# EasyEDA Pro project Sequencer.epro

# Schematic Schematic1
Board Name: Board1; Create Date: 2026-06-06; Page Name: P1; Project Name: Blinky; Schematic Name: Schematic1; Update Date: 2026-06-07; Company: EasyEDA.com; Page Size: A4; Version: V1.0
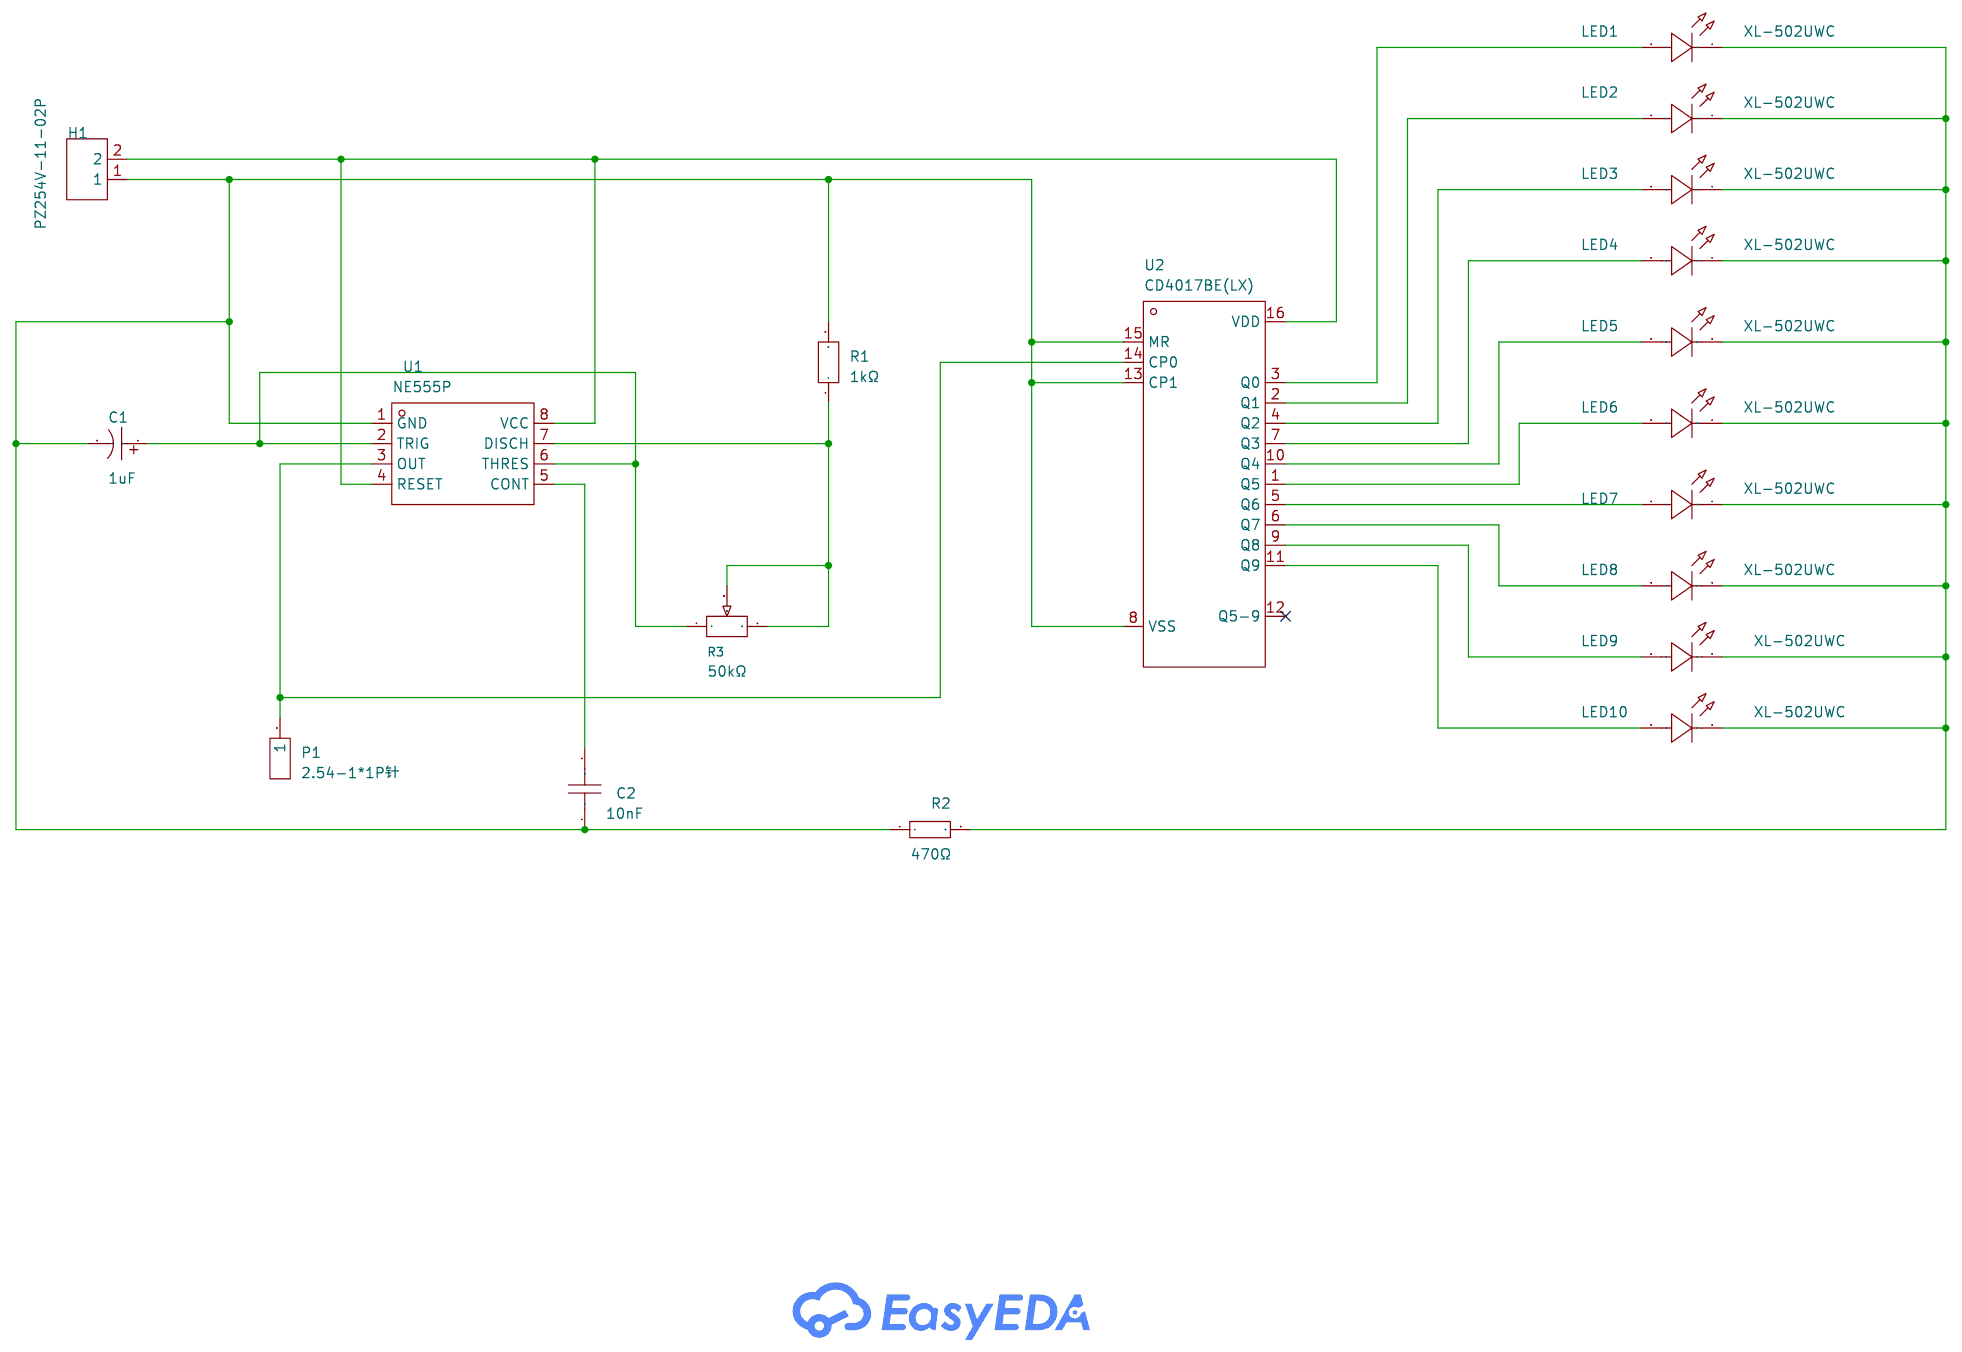
[diagram p0: schematic sheet]

## Parts
C1  1uF  [CAP-TH_BD5.0-P2.00-D0.8-FD]
C2  10nF  [CAP-TH_L8.0-W4.0-P5.00-D1.2]
H1  PZ254V-11-02P  [HDR-TH_2P-P2.54-V-M]
LED1  XL-502UWC  [LED-TH_BD5.9-P2.54-RD_WHITE]
LED2  XL-502UWC  [LED-TH_BD5.9-P2.54-RD_WHITE]
LED3  XL-502UWC  [LED-TH_BD5.9-P2.54-RD_WHITE]
LED4  XL-502UWC  [LED-TH_BD5.9-P2.54-RD_WHITE]
LED5  XL-502UWC  [LED-TH_BD5.9-P2.54-RD_WHITE]
LED6  XL-502UWC  [LED-TH_BD5.9-P2.54-RD_WHITE]
LED7  XL-502UWC  [LED-TH_BD5.9-P2.54-RD_WHITE]
LED8  XL-502UWC  [LED-TH_BD5.9-P2.54-RD_WHITE]
LED9  XL-502UWC  [LED-TH_BD5.9-P2.54-RD_WHITE]
LED10  XL-502UWC  [LED-TH_BD5.9-P2.54-RD_WHITE]
P1  2.54-1*1P针  [HDR-TH_1P-P2.54-V-M]
R1  1kΩ  [RES-TH_BD2.3-L6.5-P10.50-D0.5]
R2  470Ω  [RES-TH_BD2.2-L6.5-P10.50-D0.6]
R3  50kΩ  [RES-ADJ-TH_3P-L9.5-W4.85-P2.50-BL-L]
U1  NE555P  [DIP-8_L9.8-W6.6-P2.54-LS7.6-BL]
U2  CD4017BE(LX)  [PDIP-16_L19.3-W6.4-P2.54-LS7.94-BL]

## Library data of the parts
C1 = KF010M050C110A: Capacitance:1uF Tolerance:±20% Tolerance:±20% Voltage Rating:50V Pin Spacing:2mm Diameter:5mm Height - Seated (Max):11mm Lifetime:2000hrs@105℃; LCSC Part Name: 1uF ±20% 50V; Supplier Part: C62934; Manufacturer: CapXon(丰宾); Supplier Footprint: 插件,D5xL11mm; JLCPCB Part Class: Extended Part; Datasheet: https://item.szlcsc.com/datasheet/KF010M050C110A/63997.html; Supplier: LCSC; Tolerance: ±20%; Voltage Rating: 50V; Pin Spacing: 2mm; Diameter: 5mm; Height - Seated (Max): 11mm; Lifetime: 2000hrs@105℃; Check: true
C2 = N09F1B103MN0B0S0N0: Capacitance:10nF Tolerance:±20% Tolerance:±20% Voltage Rating:1kV Pin Spacing:5mm Temperature Coefficient:Y5V Diameter:8.5mm Body Thickness:2.5mm; LCSC Part Name: 10nF ±20% 1kV; Supplier Part: C249157; Manufacturer: STE(松田); Supplier Footprint: 插件,P=5mm; JLCPCB Part Class: Extended Part; Datasheet: https://item.szlcsc.com/datasheet/N09F1B103MN0B0S0N0/245516.html; Supplier: LCSC; Tolerance: ±20%; Voltage Rating: 1kV; Pin Spacing: 5mm; Temperature Coefficient: Y5V; Diameter: 8.5mm; Body Thickness: 2.5mm; Check: true
H1 = PZ254V-11-02P: Pin Structure:1x2P Pitch:2.54mm Row Spacing:- Circluar Pins/Square Pins:Pin Header Mounting Type:Through Hole Number of Rows:1 Number of Pins:2P Current Rating:3A Voltage Rating (Max):250V Length of Mating Pin:6mm Insulation Height:2.5mm Length of End Con; LCSC Part Name: 1x2P 间距:2.54mm 方针 直插; Supplier Part: C492401; Manufacturer: XFCN(兴飞); Supplier Footprint: 插件,P=2.54mm; JLCPCB Part Class: Extended Part; Datasheet: https://item.szlcsc.com/datasheet/PZ254V-11-02P/502957.html; Supplier: LCSC; Pin Structure: 1x2P; Pitch: 2.54mm; Circluar Pins/Square Pins: Pin Header; Mounting Type: Through Hole; Number of Rows: 1; Number of Pins: 2P; Current Rating: 3A; Voltage Rating (Max): 250V; Length of Mating Pin: 6mm; Insulation Height: 2.5mm; Length of End Connection Pin: 3mm; Contact Material: Brass; Operating Temperature: -40℃~+105℃; Color: Black; Check: true
LED1-LED10 = XL-502UWC: Lamp Holder Type:5mm round lamp head Illumination Color:White Voltage - Forward(Vf):3.3V Voltage - Forward(Vf):3.3V Power(Watts):70mW Forward Current:20mA Wavelength - Dominant:- Wavelength - Dominant:- Peak Wavelength:- Peak Wavelength:- Diode Configurat; LCSC Part Name: F5白发白短脚; Supplier Part: C2895480; Manufacturer: XINGLIGHT(成兴光); Supplier Footprint: 插件,D=5mm; JLCPCB Part Class: Extended Part; Datasheet: https://item.szlcsc.com/datasheet/XL-502UWC/3136195.html; Supplier: LCSC; Lamp Holder Type: 5mm round lamp head; Illumination Color: White; Voltage - Forward(Vf): 3.3V; Power(Watts): 70mW; Forward Current: 20mA; Diode Configuration: Discrete Diode; Lens Color: Water Clear; Color Temperature: 9000K~20000K; Luminous Intensity: 20cd; Viewing Angle: 30°; Operating Temperature: -25℃~+85℃; Check: true
P1 = 2.54-1*1P针: Pin Structure:1x1P Pitch:- Row Spacing:- Circluar Pins/Square Pins:Pin Header Mounting Type:Through Hole Number of Rows:1 Number of Pins:1P Current Rating:3A Voltage Rating (Max):- Length of Mating Pin:6mm Insulation Height:2.5mm Length of End Connection; LCSC Part Name: 1x1P 方针 直插; Supplier Part: C81276; Manufacturer: BOOMELE(博穆精密); Supplier Footprint: 插件,P=2.54mm; JLCPCB Part Class: Extended Part; Datasheet: https://item.szlcsc.com/datasheet/2.54-1*1P%25E9%2592%2588/82426.html; Supplier: LCSC; Pin Structure: 1x1P; Circluar Pins/Square Pins: Pin Header; Mounting Type: Through Hole; Number of Rows: 1; Number of Pins: 1P; Current Rating: 3A; Length of Mating Pin: 6mm; Insulation Height: 2.5mm; Length of End Connection Pin: 3mm; Contact Material: Brass; Contact Plating: Gold; Operating Temperature: -55℃~+105℃; Color: Black; Check: true
R1 = MF1/4W-1KΩ±1%T52: Type:Metal Film Resistors Resistance: Tolerance:±1% Tolerance:±1% Power(Watts):250mW Temperature Coefficient:±200ppm/℃ Temperature Coefficient:±200ppm/℃; LCSC Part Name: 金属膜电阻 1kΩ ±1% 250mW; Supplier Part: C713997; Manufacturer: 华星机电; Supplier Footprint: 插件,D2.3xL6.5mm; JLCPCB Part Class: Extended Part; Datasheet: https://atta.szlcsc.com/upload/public/pdf/source/20200731/C713882_AE8EB1102749D7E4FB4FB13DC898C429.pdf; Supplier: LCSC; Type: Metal Film Resistors; Tolerance: ±1%; Power(Watts): 250mW; Temperature Coefficient: ±200ppm/℃; Check: true
R2 = MFR0W4F4700A50: Type:Metal Film Resistors Resistance: Tolerance:±1% Tolerance:±1% Voltage-Supply(Max):250V Power(Watts):250mW Temperature Coefficient:±50ppm/℃ Temperature Coefficient:±50ppm/℃; LCSC Part Name: 470Ω ±1% 250mW 金属膜电阻 铜脚，圆柱状直插; Supplier Part: C58592; Manufacturer: UNI-ROYAL(厚声); Supplier Footprint: 插件,D2.2xL6.5mm; JLCPCB Part Class: Extended Part; Datasheet: https://atta.szlcsc.com/upload/public/pdf/source/20191012/C436293_8820AA14BC71FA35E551C06C441482A0.pdf; Supplier: LCSC; Type: Metal Film Resistors; Tolerance: ±1%; Voltage-Supply(Max): 250V; Power(Watts): 250mW; Temperature Coefficient: ±50ppm/℃; Check: true
R3 = 3296X-1-503_C118912: Resistance:50kΩ Tolerance:±10% Tolerance:±10% Power(Watts):500mW Temperature Coefficient:±250ppm/℃ Temperature Coefficient:±250ppm/℃ Number of Turns:30; LCSC Part Name: 50kΩ ±10%; Supplier Part: C118912; Manufacturer: BOCHEN(博晨); Manufacturer Part: 3296X-1-503; Supplier Footprint: 插件-3P,9.5x4.9mm; JLCPCB Part Class: Extended Part; Datasheet: https://item.szlcsc.com/datasheet/3296X-1-503/120181.html; Supplier: LCSC; Tolerance: ±10%; Power(Watts): 500mW; Temperature Coefficient: ±250ppm/℃; Number of Turns: 30; Check: true
U1 = NE555P: Timer Number:1 Voltage - Supply:4.5V~16V Voltage - Supply:4.5V~16V Output Current:200mA Supply Current:2mA Operating Temperature:0℃~+70℃ Operating Temperature:0℃~+70℃ Features:占空比可调振荡；复位功能; LCSC Part Name: 555精密定时器; Supplier Part: C46749; Manufacturer: TI(德州仪器); Supplier Footprint: DIP-8; JLCPCB Part Class: Extended Part; Datasheet: https://www.ti.com/cn/lit/gpn/ne555; Supplier: LCSC; Timer Number: 1; Voltage - Supply: 4.5V~16V; Output Current: 200mA; Supply Current: 2mA; Operating Temperature: 0℃~+70℃; Features: 占空比可调振荡；复位功能; Check: true
U2 = CD4017BE(LX): Logic Type:Divide-by-10 Direction:Up Counter Voltage - Supply:3V~15V Voltage - Supply:3V~15V Number of Elements:1 Trigger Type:Rising Edge Reset:Asynchronous Count Rate:11MHz Operating Temperature:-40℃~+85℃ Operating Temperature:-40℃~+85℃ Propagation Dela; LCSC Part Name: 5级约翰逊十进制计数器; Supplier Part: C32710674; Manufacturer: LX(灵星芯微); Supplier Footprint: DIP-16; JLCPCB Part Class: Extended Part; Datasheet: https://item.szlcsc.com/datasheet/CD4017BE(LX)/34444193.html; Supplier: LCSC; Logic Type: Divide-by-10; Direction: Up Counter; Voltage - Supply: 3V~15V; Number of Elements: 1; Trigger Type: Rising Edge; Reset: Asynchronous; Count Rate: 11MHz; Operating Temperature: -40℃~+85℃; Propagation Delay: 85ns; Check: true

## Nets
$1N1257: C2.2 U1.5(CONT)
$1N1329: H1.2 U1.4(RESET) U1.8(VCC) U2.16(VDD)
$1N1704: R1.1 R3.2 R3.3 U1.7(DISCH)
$1N1727: P1.1 U1.3(OUT) U2.14(CP0)
$1N1735: C1.1 R3.1 U1.2(TRIG) U1.6(THRES)
$1N1773: C1.2 C2.1 H1.1 R1.2 R2.1 U1.1(GND) U2.8(VSS) U2.13(CP1) U2.15(MR)
$1N2043: LED1.2(A) U2.3(Q0)
$1N2050: LED1.1(K) LED2.1(K) LED3.1(K) LED4.1(K) LED5.1(K) LED6.1(K) LED7.1(K) LED8.1(K) LED9.1(K) LED10.1(K) R2.2
$1N2230: LED2.2(A) U2.2(Q1)
$1N2247: LED3.2(A) U2.4(Q2)
$1N2267: LED4.2(A) U2.7(Q3)
$1N2288: LED5.2(A) U2.10(Q4)
$1N2317: LED6.2(A) U2.1(Q5)
$1N2342: LED7.2(A) U2.5(Q6)
$1N2369: LED8.2(A) U2.6(Q7)
$1N2398: LED9.2(A) U2.9(Q8)
$1N2429: LED10.2(A) U2.11(Q9)

Not connected (* = marked no-connect by the designer): U2 12(Q5-9)*

# Board PCB1
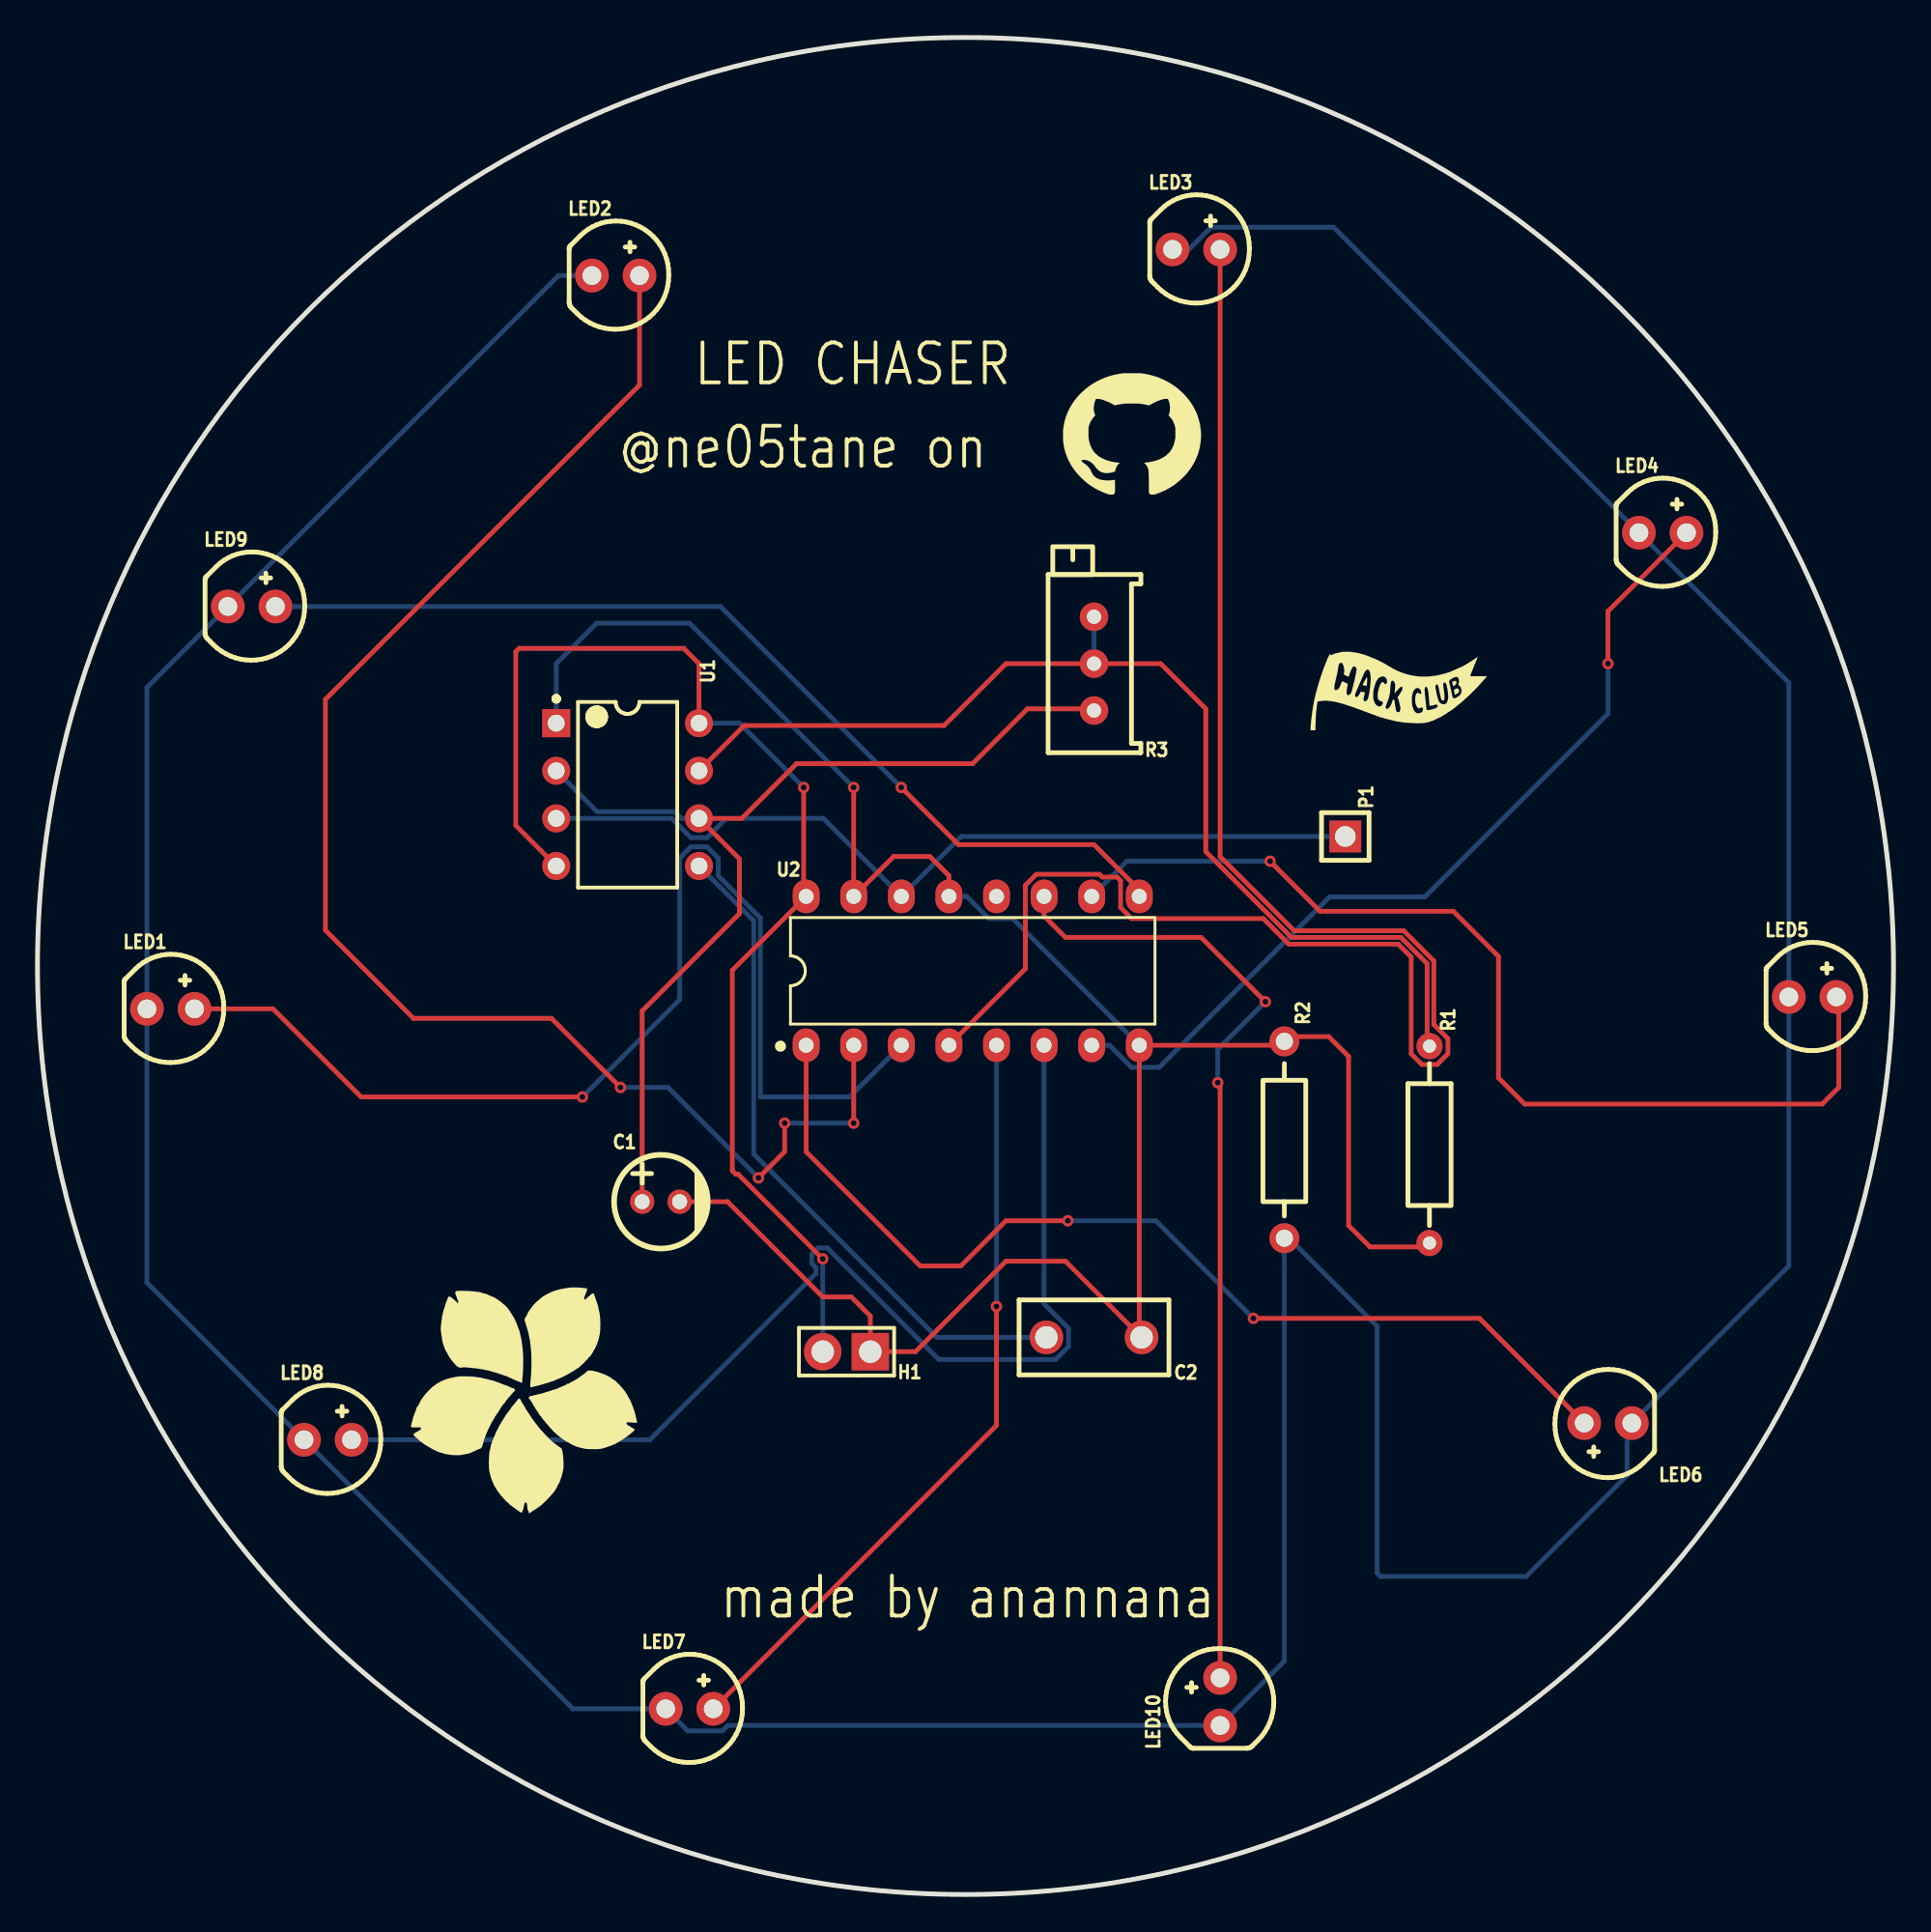
[diagram p1: board, top side]
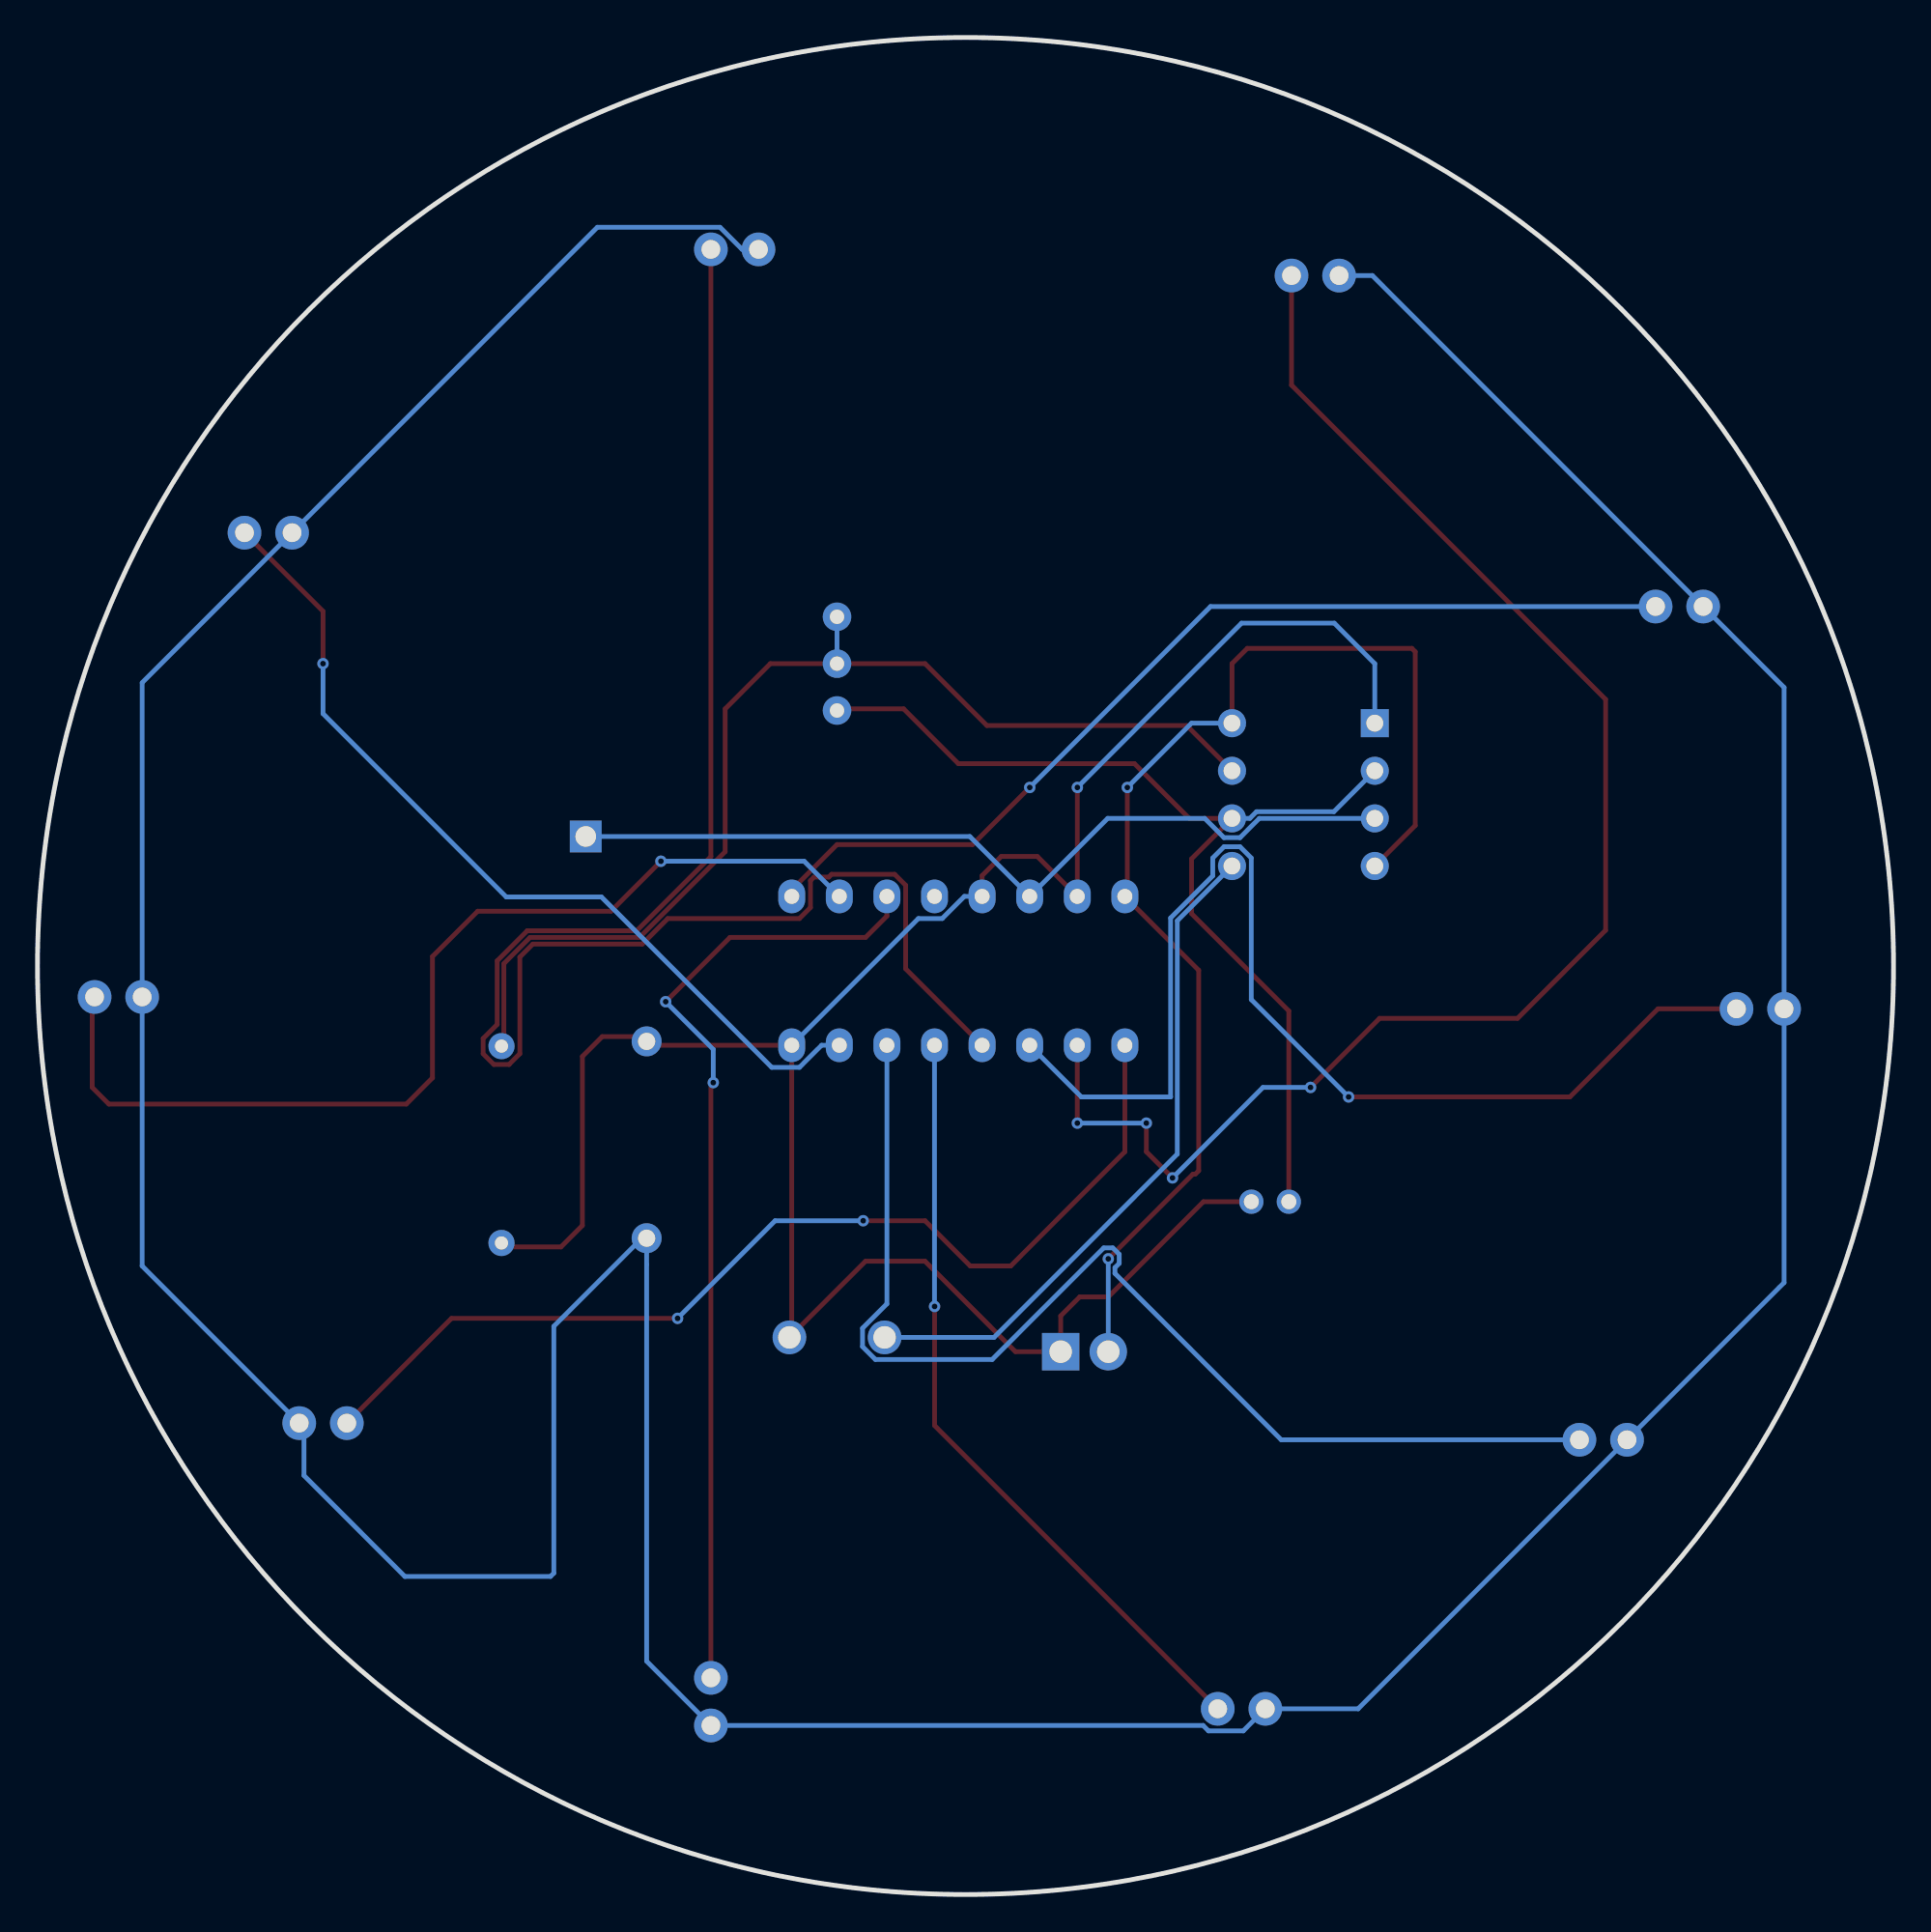
[diagram p2: board, bottom side, seen from below]

Outline 99.06 x 99.06 mm; copper layers: Top Layer, Bottom Layer. Coordinates in mm from the lower left corner of the outline.
Outline path: circle c49.53,49.53 r49.53
Stack: Top Layer 0.035mm / Dielectric1 1.51mm FR4 er 4.5 / Bottom Layer 0.035mm

## Design rules (mm)
template: JLCPCB Capability(Two Layers Board)
spacing copperThickness1oz (default): track to track 0.102, other pairs 0.152 to 0.3
spacing copperThickness2oz: track to track 0.203, other pairs 0.152 to 0.3
track width copperThickness1oz (default): min 0.127, default 0.254, max 2.54
track width copperThickness2oz: min 0.203, default 0.254, max 2.54
differential pair differentialPair (default): width min 0.127, default 0.254, max 2.54; gap min 0.152, default 0.152
via viaSize (default): diameter min 0.5, default 0.61, max 10; hole min 0.3, default 0.305, max 6.3

## Placement (name value [footprint] x y rotation side)
C1  1uF  [CAP-TH_BD5.0-P2.00-D0.8-FD]  33.27 36.96 0 top
C2  10nF  [CAP-TH_L8.0-W4.0-P5.00-D1.2]  56.39 29.72 180 top
H1  PZ254V-11-02P  [HDR-TH_2P-P2.54-V-M]  43.18 28.96 180 top
LED1  XL-502UWC  [LED-TH_BD5.9-P2.54-RD_WHITE]  7.11 47.24 0 top
LED2  XL-502UWC  [LED-TH_BD5.9-P2.54-RD_WHITE]  30.86 86.36 0 top
LED3  XL-502UWC  [LED-TH_BD5.9-P2.54-RD_WHITE]  61.85 87.76 0 top
LED4  XL-502UWC  [LED-TH_BD5.9-P2.54-RD_WHITE]  86.74 72.64 0 top
LED5  XL-502UWC  [LED-TH_BD5.9-P2.54-RD_WHITE]  94.74 47.88 0 top
LED6  XL-502UWC  [LED-TH_BD5.9-P2.54-RD_WHITE]  83.82 25.15 180 top
LED7  XL-502UWC  [LED-TH_BD5.9-P2.54-RD_WHITE]  34.8 9.91 0 top
LED8  XL-502UWC  [LED-TH_BD5.9-P2.54-RD_WHITE]  15.49 24.26 0 top
LED9  XL-502UWC  [LED-TH_BD5.9-P2.54-RD_WHITE]  11.43 68.71 0 top
LED10  XL-502UWC  [LED-TH_BD5.9-P2.54-RD_WHITE]  63.12 10.29 90 top
P1  2.54-1*1P针  [HDR-TH_1P-P2.54-V-M]  69.8 56.44 270 top
R1  1kΩ  [RES-TH_BD2.3-L6.5-P10.50-D0.5]  74.29 40.01 270 top
R2  470Ω  [RES-TH_BD2.2-L6.5-P10.50-D0.6]  66.55 40.26 270 top
R3  50kΩ  [RES-ADJ-TH_3P-L9.5-W4.85-P2.50-BL-L]  56.39 65.66 180 top
U1  NE555P  [DIP-8_L9.8-W6.6-P2.54-LS7.6-BL]  31.5 58.67 270 top
U2  CD4017BE(LX)  [PDIP-16_L19.3-W6.4-P2.54-LS7.94-BL]  49.91 49.27 0 top

## Footprints (pads in the part's own frame, mm; a bottom-side part is the same pattern mirrored in y, then rotated)
CAP-TH_BD5.0-P2.00-D0.8-FD
  round 1.3 hole 0.8: 1(-1,0) 2(1,0)
CAP-TH_L8.0-W4.0-P5.00-D1.2
  round 1.8 hole 1.2: 1(-2.54,0) 2(2.54,0)
DIP-8_L9.8-W6.6-P2.54-LS7.6-BL
  rect 1.5x1.5 hole 0.9: 1(-3.81,-3.81)
  round 1.5 hole 0.9: 2(-1.27,-3.81) 3(1.27,-3.81) 4(3.81,-3.81) 5(3.81,3.81) 6(1.27,3.81) 7(-1.27,3.81) 8(-3.81,3.81)
HDR-TH_1P-P2.54-V-M
  rect 1.7x1.7 hole 1.1: 1(0,0)
HDR-TH_2P-P2.54-V-M
  rect 2x2 hole 1.2: 1(-1.27,0)
  round 2 hole 1.2: 2(1.27,0)
LED-TH_BD5.9-P2.54-RD_WHITE
  round 1.8 hole 1: 1(-1.27,0) 2(1.27,0)
PDIP-16_L19.3-W6.4-P2.54-LS7.94-BL
  oval 1.44x1.8 hole 0.8: 1(-8.89,-3.97) 2(-6.35,-3.97) 3(-3.81,-3.97) 4(-1.27,-3.97) 5(1.27,-3.97) 6(3.81,-3.97) 7(6.35,-3.97) 8(8.89,-3.97) 9(8.89,3.97) 10(6.35,3.97) 11(3.81,3.97) 12(1.27,3.97) 13(-1.27,3.97) 14(-3.81,3.97) 15(-6.35,3.97) 16(-8.89,3.97)
RES-ADJ-TH_3P-L9.5-W4.85-P2.50-BL-L
  round 1.524 hole 0.762: 1(0,2.5) 2(0,0) 3(0,-2.5)
RES-TH_BD2.2-L6.5-P10.50-D0.6
  round 1.6 hole 0.914: 1(-5.25,0) 2(5.25,0)
RES-TH_BD2.3-L6.5-P10.50-D0.5
  round 1.4 hole 0.7: 1(-5.25,0) 2(5.25,0)

## Nets
As in the schematic.

Pads without a net: U2 12

## Via types
v1: diameter 0.61, hole 0.305, Top Layer to Bottom Layer, 16 vias

## Routing (per net, layer and track width the routed paths; a pad name or vN(x,y) marks a point on that pad's centre or on a via; arc(x,y) is an arc through that point)
$1N1257: length 36.2
  Bottom Layer w0.254: 53.85,29.72 48.01,29.72 38.23,39.5 38.23,51.94 U1.5
$1N1329: length 66.6
  Top Layer w0.254: U1.8 35.31,65.66 34.49,66.47 25.71,66.47 25.53,66.29 25.53,57.02 U1.4 ; v1(41.91,33.91) 37.39,38.43 37.26,38.43 37.08,38.61 37.08,49.3 U2.16 40.89,53.37 v1(40.89,59.06)
  Bottom Layer w0.254: U1.8 37.47,62.48 v1(40.89,59.06) ; v1(41.91,33.91) 41.91,28.96
$1N1704: length 59.3
  Top Layer w0.254: U1.7 37.72,62.36 48.39,62.36 51.69,65.66 R3.2 59.94,65.66 62.36,63.25 62.36,55.63 66.93,51.05 72.77,51.05 74.17,49.66 74.17,45.38 R1.1
  Bottom Layer w0.254: R3.3 R3.2
$1N1727: length 46
  Bottom Layer w0.254: P1.1 49.3,56.44 U2.14 41.94,57.4 36.76,57.4 35.73,56.38 34.88,56.38 33.85,57.4 U1.3
$1N1735: length 55.7
  Top Layer w0.254: C1.1 32.27,47.13 37.47,52.32 37.47,55.25 U1.6 37.59,57.4 40.51,60.33 49.91,60.33 52.83,63.25 56.3,63.25 R3.1
  Bottom Layer w0.254: U1.6 34.35,57.4 34,57.76 29.87,57.76 U1.2
$1N1773: length 124.3
  Top Layer w0.254: v1(43.56,59.06) 43.56,53.25 U2.15 45.69,55.37 47.62,55.37 48.64,54.35 U2.13 ; R1.2 74.08,34.54 71.12,34.54 69.98,35.69 69.98,44.7 68.92,45.76 66.55,45.76 66.09,45.3 U2.8 58.8,29.84 ; 58.8,29.84 C2.1 ; 58.8,29.84 54.86,33.78 51.69,33.78 46.86,28.96 H1.1 44.45,30.86 43.43,31.88 41.91,31.88 36.83,36.96 C1.2
  Bottom Layer w0.254: U2.13 49.59,53.24 50.77,52.06 52.04,52.06 U2.8 ; U1.1 27.69,65.66 29.84,67.82 34.8,67.82 v1(43.56,59.06)
$1N2043: length 62.4
  Top Layer w0.254: LED1.2 12.57,47.24 17.27,42.55 v1(29.08,42.55)
  Bottom Layer w0.254: U2.3 43.35,42.55 38.58,42.55 38.58,52.09 36.33,54.34 36.33,55.29 35.73,55.89 34.88,55.89 34.28,55.29 34.28,47.74 v1(29.08,42.55)
$1N2050: length 284.7
  Bottom Layer w0.254: LED2.1 27.81,86.36 LED9.1 5.84,64.39 LED1.1 5.84,32.64 LED8.1 28.57,9.91 LED7.1 34.71,8.73 36.56,8.73 36.85,9.02 LED10.1 66.55,12.45 66.55,35.26 71.5,30.31 71.5,17.15 71.68,16.97 79.45,16.97 84.84,22.35 84.84,24.89 LED6.1 93.47,33.53 LED5.1 93.47,64.64 LED4.1 69.18,88.94 62.63,88.94 61.45,87.76 LED3.1
$1N2230: length 81.8
  Top Layer w0.254: v1(31.11,43.05) 27.43,46.74 20.07,46.74 15.37,51.44 15.37,63.75 32.13,80.52 LED2.2 ; U2.2 43.56,41.15 v1(43.56,41.15) ; v1(38.48,38.23) 39.88,39.62 v1(39.88,41.15)
  Bottom Layer w0.254: v1(31.11,43.05) 33.66,43.05 v1(38.48,38.23) ; v1(39.88,41.15) v1(43.56,41.15)
$1N2247: length 92.7
  Top Layer w0.254: U2.4 52.73,49.38 52.73,53.84 53.31,54.42 56.68,54.42 56.82,54.28 57.62,54.28 57.81,54.09 57.81,52.65 58.39,52.06 65.42,52.06 66.78,50.7 72.62,50.7 73.32,50.01 73.32,44.85 73.89,44.28 74.7,44.28 75.27,44.85 75.27,45.66 74.52,46.41 74.52,49.8 72.92,51.41 67.08,51.41 63.12,55.37 LED3.2
$1N2267: length 47.2
  Top Layer w0.254: LED4.2 83.82,68.45 v1(83.82,65.66)
  Bottom Layer w0.254: v1(83.82,65.66) 83.82,62.99 74.04,53.21 68.96,53.21 59.87,44.12 58.39,44.12 57.21,45.3 U2.7
$1N2288: length 55.1
  Top Layer w0.254: v1(65.79,55.12) 68.45,52.45 75.56,52.45 77.98,50.04 77.98,43.56 79.38,42.16 95.25,42.16 96.14,43.05 96.14,47.75 LED5.2
  Bottom Layer w0.254: v1(65.79,55.12) 58.14,55.12 U2.10
$1N2317: length 55.2
  Top Layer w0.254: U2.1 41.02,39.62 47.12,33.53 49.28,33.53 51.69,35.94 v1(54.99,35.94) ; v1(64.9,30.73) 76.96,30.73 LED6.2
  Bottom Layer w0.254: v1(64.9,30.73) 59.69,35.94 v1(54.99,35.94)
$1N2342: length 41.7
  Top Layer w0.254: v1(51.18,31.37) 51.18,25.02 36.07,9.91
  Bottom Layer w0.254: v1(51.18,31.37) 51.18,31.37 U2.5
$1N2369: length 62.8
  Bottom Layer w0.254: U2.6 53.72,31.51 55.03,30.21 55.03,29.23 54.34,28.54 48.11,28.54 42.15,34.49 41.67,34.49 41.33,34.15 41.33,33.67 41.55,33.44 41.55,33.13 32.68,24.26 LED8.2
$1N2398: length 52.7
  Top Layer w0.254: v1(46.1,59.06) 49.15,56.01 56.39,56.01 58.8,53.59 U2.9
  Bottom Layer w0.254: v1(46.1,59.06) 36.45,68.71 LED9.2
$1N2429: length 51.9
  Top Layer w0.254: U2.11 53.72,52.19 54.86,51.05 62.1,51.05 v1(65.53,47.63) ; LED10.2 63.12,43.18 v1(62.99,43.31)
  Bottom Layer w0.254: v1(65.53,47.63) 62.99,45.09 v1(62.99,43.31)

## Text on the board
Top Silkscreen Layer: @ne05tane on | LED CHASER | made by anannana
